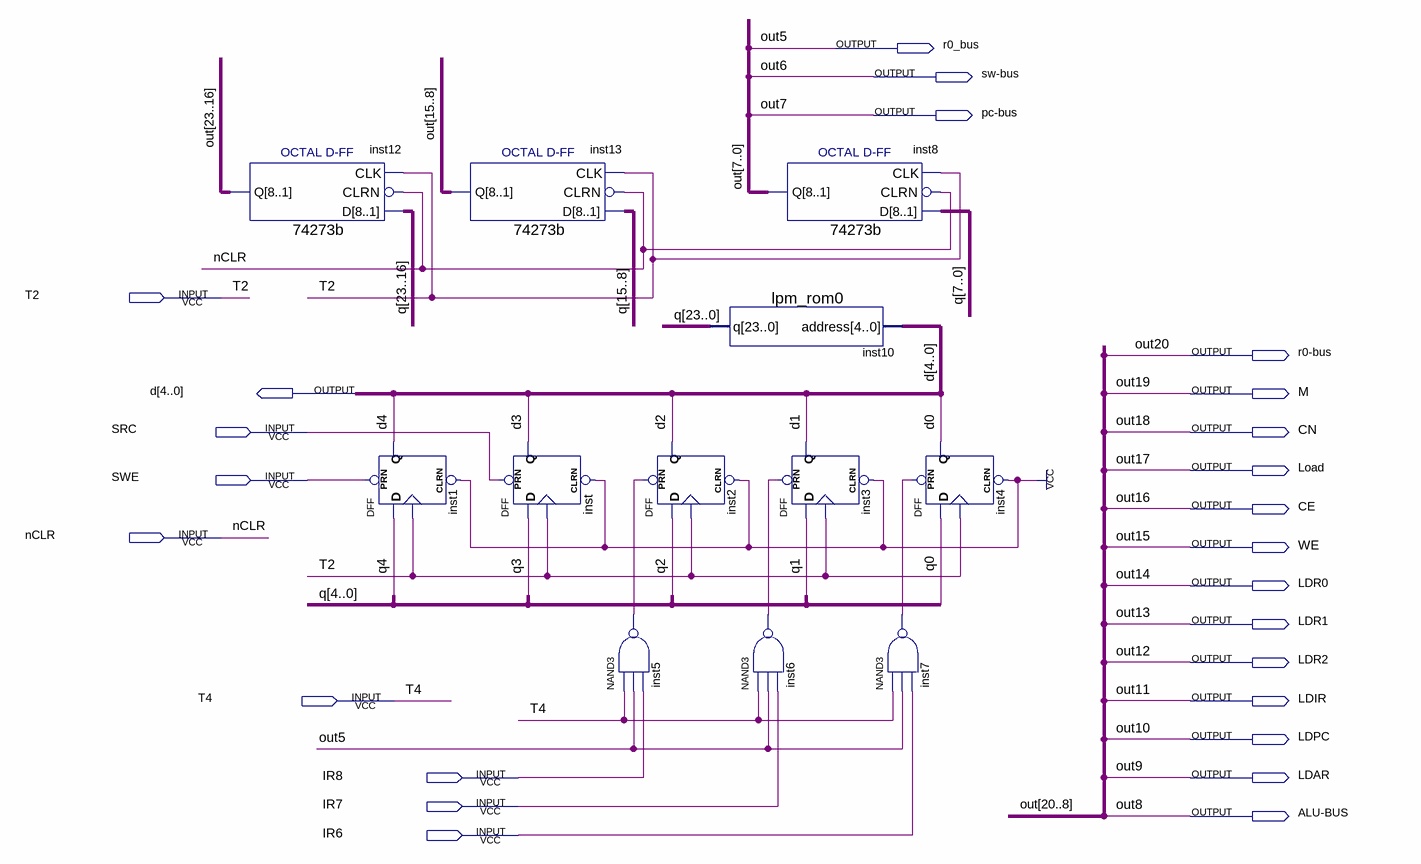
[diagram p0: schematic sheet]
// Quartus schematic MyControl.bdf as structural Verilog: 12 symbols, 25 pins
module MyControl (
  input  T2,
  input  SRC,
  input  SWE,
  input  nCLR,
  input  T4,
  input  IR8,
  input  IR7,
  input  IR6,
  output r0_bus,
  output \sw-bus ,
  output \pc-bus ,
  output \r0-bus ,
  output [4:0] d,
  output M,
  output CN,
  output Load,
  output CE,
  output WE,
  output LDR0,
  output LDR1,
  output LDR2,
  output LDIR,
  output LDPC,
  output LDAR,
  output \ALU-BUS 
);

  wire inst5_out, inst6_out, inst7_out;
  wire [23:0] out, q;

  \74273b  inst12 (.CLK(T2), .D(q[23:16]), .CLRN(nCLR), .Q({out[23:21], \r0-bus , M, CN, Load, CE}));
  DFF inst1 (.CLRN(1'b1), .CLK(T2), .D(q[4]), .PRN(SWE), .Q(d[4]));
  \74273b  inst13 (.CLK(T2), .D(q[15:8]), .CLRN(nCLR), .Q({WE, LDR0, LDR1, LDR2, LDIR, LDPC, LDAR, \ALU-BUS }));
  DFF inst (.CLRN(1'b1), .CLK(T2), .D(q[3]), .PRN(SRC), .Q(d[3]));
  DFF inst2 (.CLRN(1'b1), .CLK(T2), .D(q[2]), .PRN(inst5_out), .Q(d[2]));
  nand inst5 (inst5_out, T4, r0_bus, IR8);
  lpm_rom0 inst10 (.address(d), .q(q));
  \74273b  inst8 (.CLK(T2), .D(q[7:0]), .CLRN(nCLR), .Q({\pc-bus , \sw-bus , r0_bus, out[4:0]}));
  DFF inst3 (.CLRN(1'b1), .CLK(T2), .D(q[1]), .PRN(inst6_out), .Q(d[1]));
  nand inst6 (inst6_out, T4, r0_bus, IR7);
  nand inst7 (inst7_out, T4, r0_bus, IR6);
  DFF inst4 (.CLRN(1'b1), .CLK(T2), .D(q[0]), .PRN(inst7_out), .Q(d[0]));

  // Other names for the same wires on the sheet: out[20:5] = {\r0-bus , M, CN, Load, CE, WE, LDR0, LDR1, LDR2, LDIR, LDPC, LDAR, \ALU-BUS , \pc-bus , \sw-bus , r0_bus};
  //   out5 = r0_bus; out6 = \sw-bus ; out7 = \pc-bus ; out8 = \ALU-BUS ; out9 = LDAR; out10 = LDPC; out11 = LDIR;
  //   out12 = LDR2; out13 = LDR1; out14 = LDR0; out15 = WE; out16 = CE; out17 = Load; out18 = CN; out19 = M;
  //   out20 = \r0-bus 
endmodule
